# EAGLE schematic EasyCheck_rev1 (EAGLE 9.4.0)
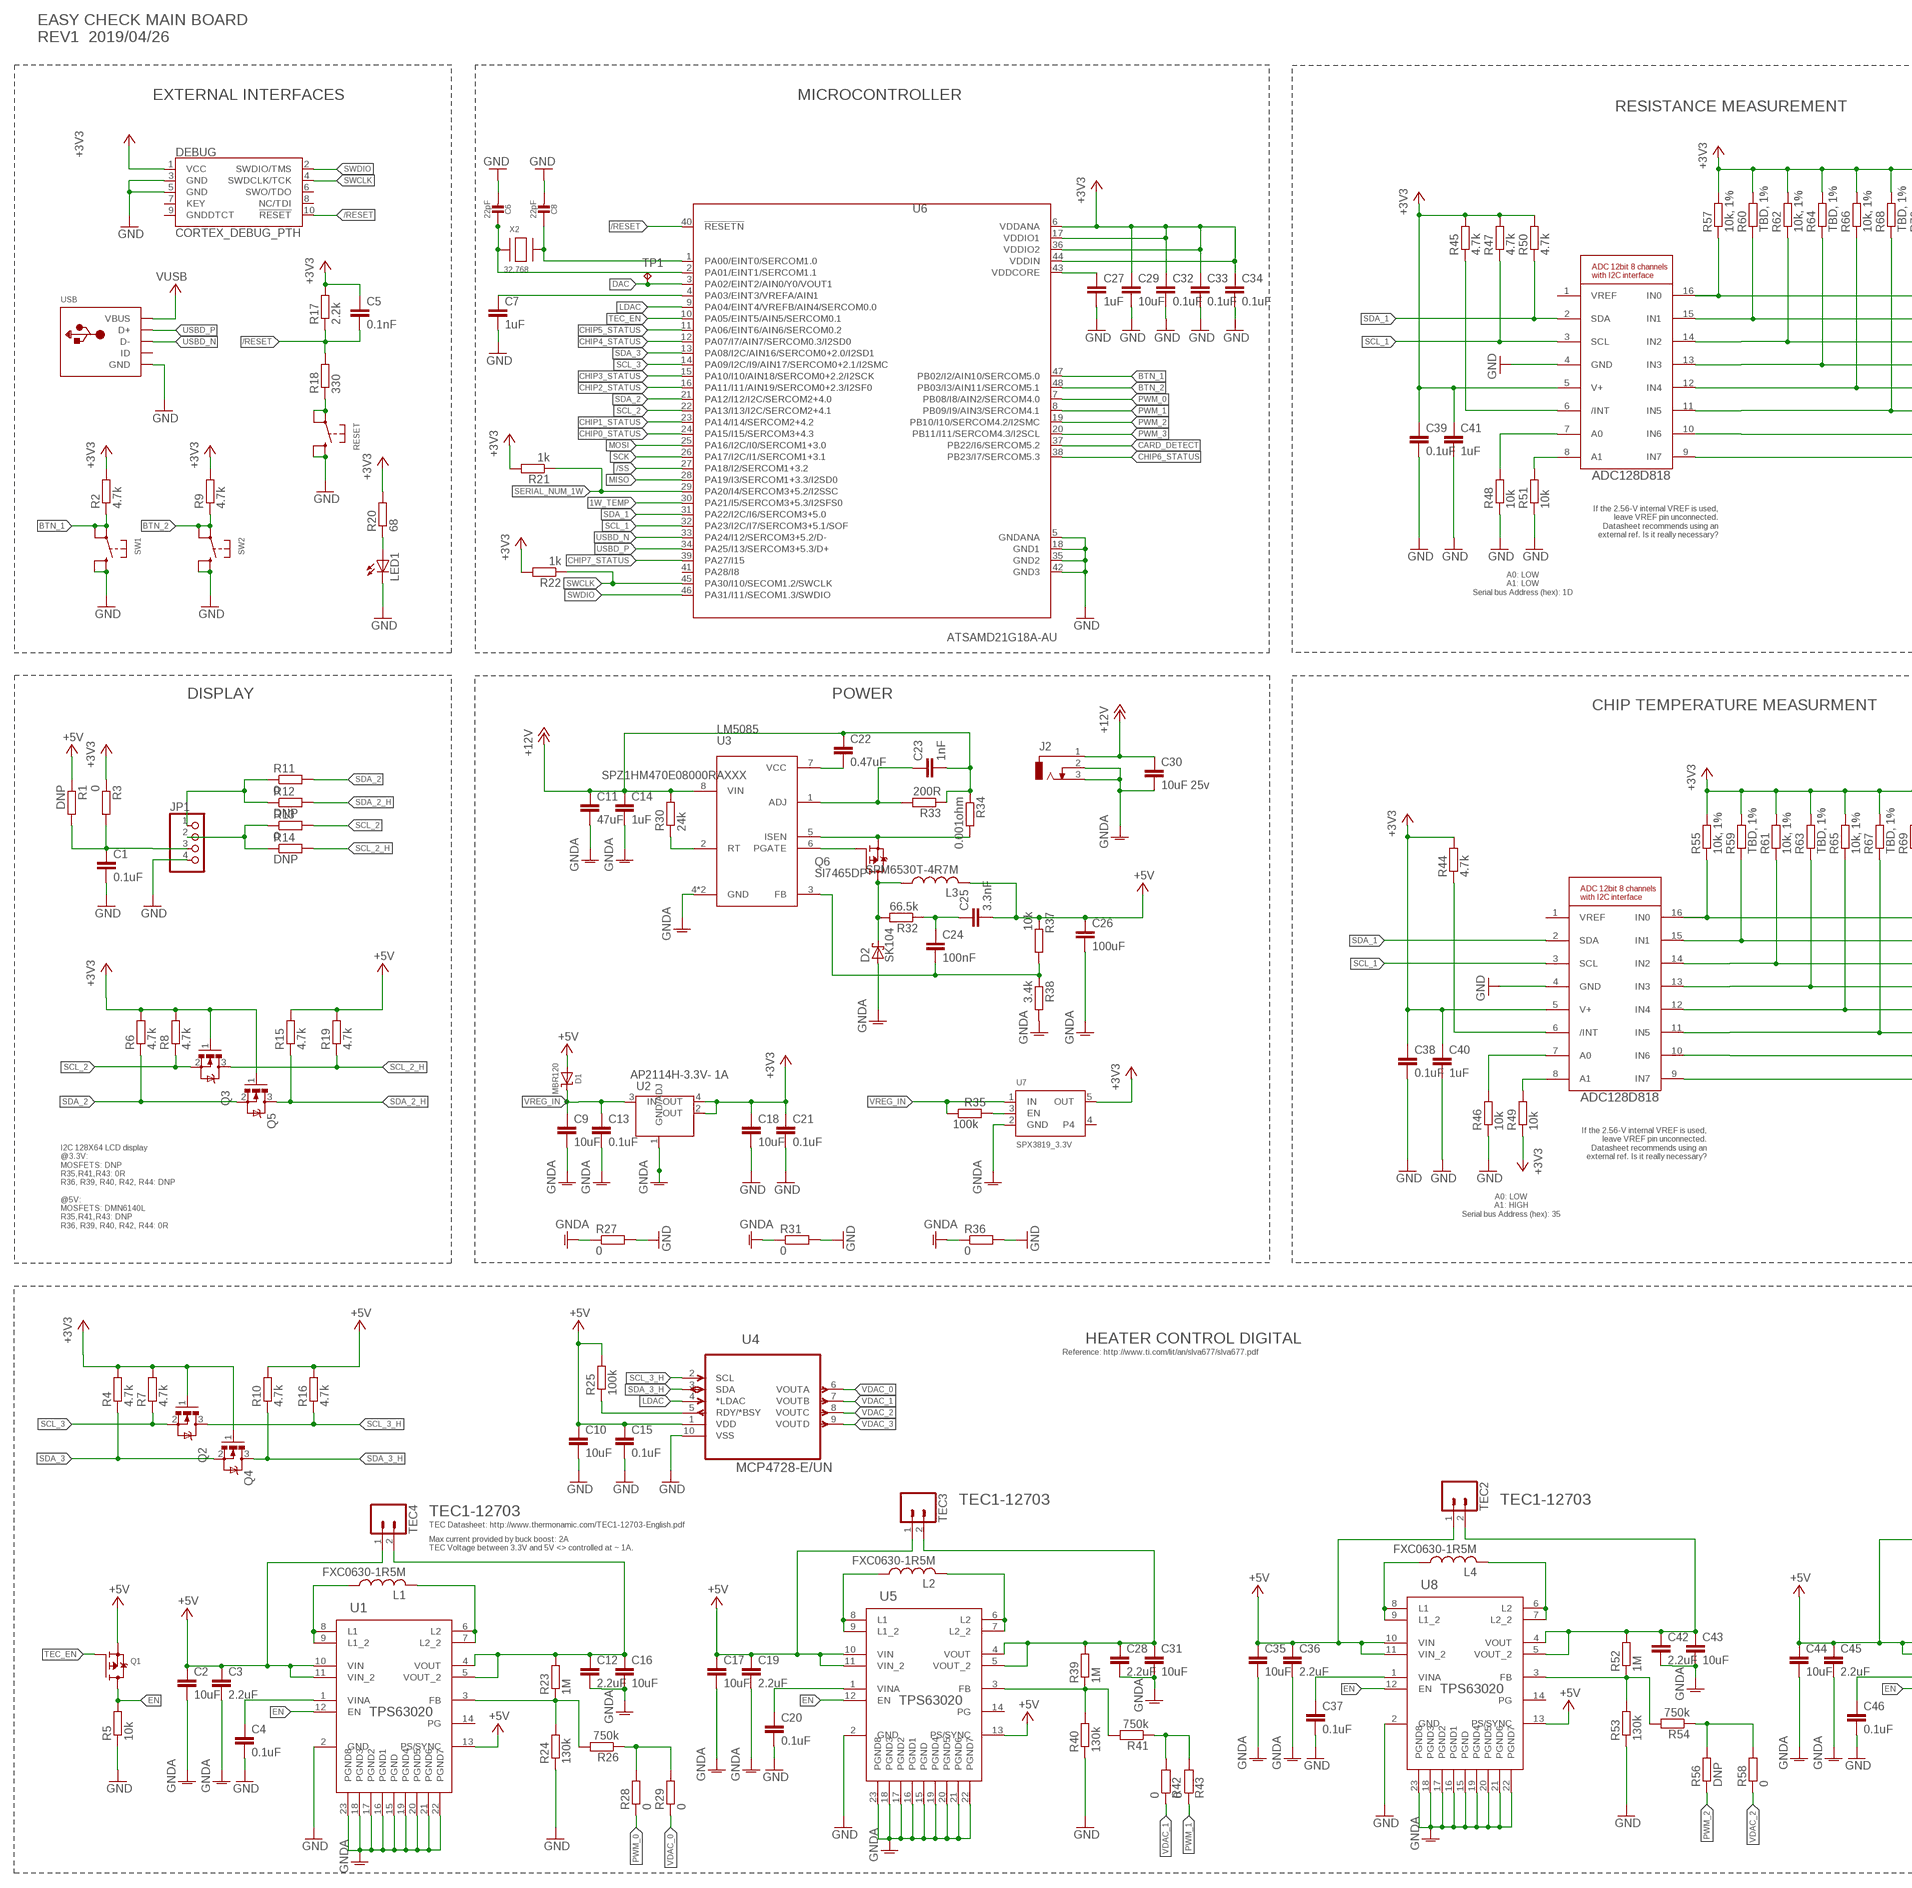
[diagram p0: schematic, sheet 1, part 1 of 2]
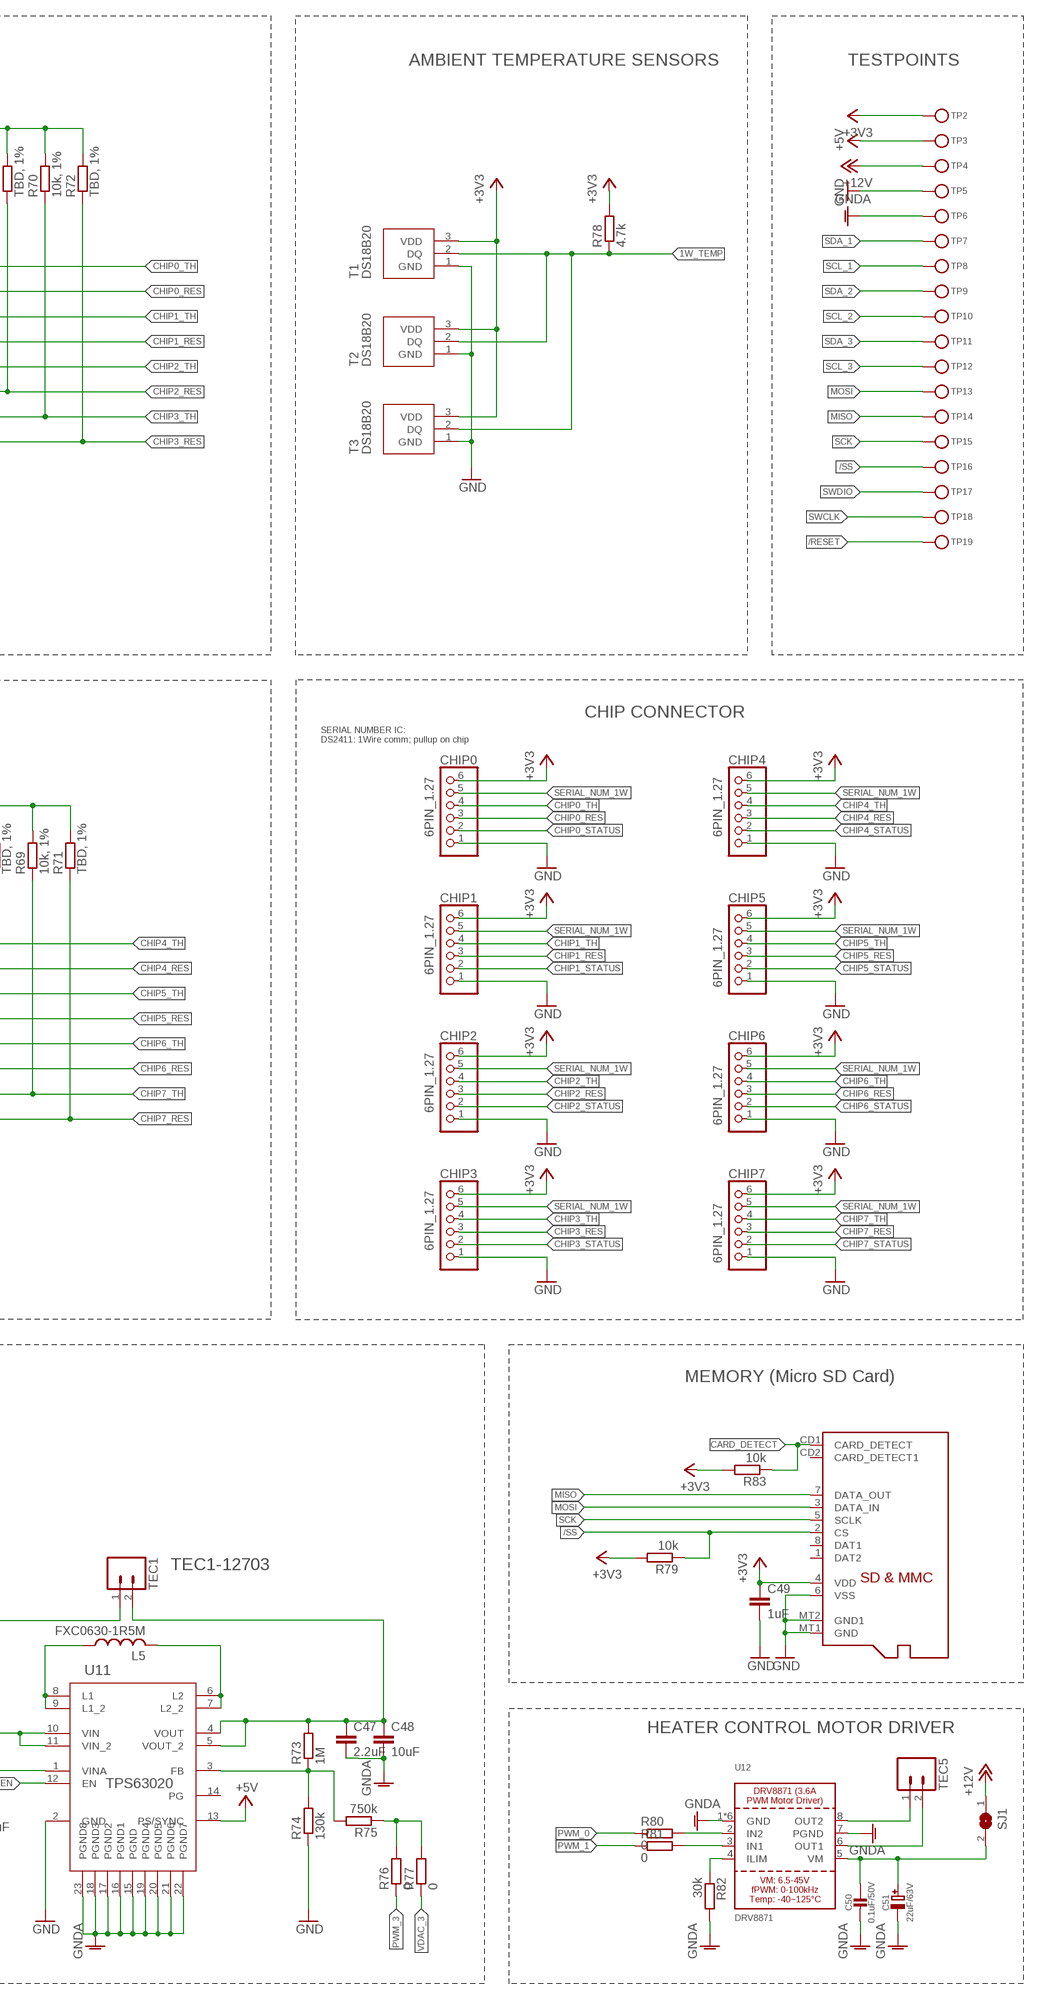
[diagram p1: schematic, sheet 1, part 2 of 2]

## Parts
C1  0.1uF  C-EUC0603  [C0603]
C2  10uF  C-EUC0805  [C0805]
C3  2.2uF  C-EUC0805  [C0805]
C4  0.1uF  C-EUC0603  [C0603]
C5  0.1nF  C-EUC0603  [C0603]
C6  22pF  CAP_CERAMIC0603_NO  [0603-NO]
C7  1uF  C-EUC0603  [C0603]
C8  22pF  CAP_CERAMIC0603_NO  [0603-NO]
C9  10uF  C-EUC0603  [C0603]
C10  10uF  C-EUC0603  [C0603]
C11  47uF  C-EUC1206  [C1206]
C12  2.2uF  C-EUC0805  [C0805]
C13  0.1uF  C-EUC0603  [C0603]
C14  1uF  C-EUC1206  [C1206]
C15  0.1uF  C-EUC0603  [C0603]
C16  10uF  C-EUC0805  [C0805]
C17  10uF  C-EUC0805  [C0805]
C18  10uF  C-EUC0603  [C0603]
C19  2.2uF  C-EUC0805  [C0805]
C20  0.1uF  C-EUC0603  [C0603]
C21  0.1uF  C-EUC0603  [C0603]
C22  0.47uF  C-EUC1206  [C1206]
C23  1nF  C-EUC0603  [C0603]
C24  100nF  C-EUC0603  [C0603]
C25  3.3nF  C-EUC0603  [C0603]
C26  100uF  C-EUC1206  [C1206]
C27  1uF  C-EUC0603  [C0603]
C28  2.2uF  C-EUC0805  [C0805]
C29  10uF  C-EUC0603  [C0603]
C30  10uF 25v  C-EUC1206  [C1206]
C31  10uF  C-EUC0805  [C0805]
C32  0.1uF  C-EUC0603  [C0603]
C33  0.1uF  C-EUC0603  [C0603]
C34  0.1uF  C-EUC0603  [C0603]
C35  10uF  C-EUC0603  [C0603]
C36  2.2uF  C-EUC0603  [C0603]
C37  0.1uF  C-EUC0603  [C0603]
C38  0.1uF  C-EUC0603  [C0603]
C39  0.1uF  C-EUC0603  [C0603]
C40  1uF  C-EUC0603  [C0603]
C41  1uF  C-EUC0603  [C0603]
C42  2.2uF  C-EUC0805  [C0805]
C43  10uF  C-EUC0805  [C0805]
C44  10uF  C-EUC0805  [C0805]
C45  2.2uF  C-EUC0805  [C0805]
C46  0.1uF  C-EUC0603  [C0603]
C47  2.2uF  C-EUC0805  [C0805]
C48  10uF  C-EUC0805  [C0805]
C49  1uF  C-EUC0603  [C0603]
C50  0.1uF/50V  CAP_CERAMIC0805-NOOUTLINE  [0805-NO]
C51  22uF/63V  CAP_ELECTROLYTICPANASONIC_D  [PANASONIC_D]
CHIP0  6PIN_1.27  [6X1PIN_1.27]
CHIP1  6PIN_1.27  [6X1PIN_1.27]
CHIP2  6PIN_1.27  [6X1PIN_1.27]
CHIP3  6PIN_1.27  [6X1PIN_1.27]
CHIP4  6PIN_1.27  [6X1PIN_1.27]
CHIP5  6PIN_1.27  [6X1PIN_1.27]
CHIP6  6PIN_1.27  [6X1PIN_1.27]
CHIP7  6PIN_1.27  [6X1PIN_1.27]
D1  MBR120  MICROBUILDER_DIODE-SCHOTTKYSOD-123  [MICROBUILDER_SOD-123]
D2  SK104  [SK104]
DEBUG  CORTEX_DEBUG_PTH  [2X5-PTH-1.27MM]
J2  DCJ0303  [DCJ0303]
JP1  PINHD-1X4  [1X04]
L1  FXC0630-1R5M  L-USPIS2816  [PIS2816]
L2  FXC0630-1R5M  L-USPIS2816  [PIS2816]
L3  SPM6530T-4R7M  [SPM6530T-4R7M]
L4  FXC0630-1R5M  L-USPIS2816  [PIS2816]
L5  FXC0630-1R5M  L-USPIS2816  [PIS2816]
LED1  LEDCHIPLED_0603  [CHIPLED_0603]
Q1  MICROBUILDER_MOSFET-P  [MICROBUILDER_SOT23-R]
Q2  DMN6140L  [SOT91P240X110-3N]
Q3  DMN6140L  [SOT91P240X110-3N]
Q4  DMN6140L  [SOT91P240X110-3N]
Q5  DMN6140L  [SOT91P240X110-3N]
Q6  SI7465DP  [SI7465]
R1  DNP  R-EU_R0603  [R0603]
R2  4.7k  R-EU_R0603  [R0603]
R3  0  R-EU_R0603  [R0603]
R4  4.7k  R-EU_R0603  [R0603]
R5  10k  R-EU_R0603  [R0603]
R6  4.7k  R-EU_R0603  [R0603]
R7  4.7k  R-EU_R0603  [R0603]
R8  4.7k  R-EU_R0603  [R0603]
R9  4.7k  R-EU_R0603  [R0603]
R10  4.7k  R-EU_R0603  [R0603]
R11  0  R-EU_R0603  [R0603]
R12  DNP  R-EU_R0603  [R0603]
R13  0  R-EU_R0603  [R0603]
R14  DNP  R-EU_R0603  [R0603]
R15  4.7k  R-EU_R0603  [R0603]
R16  4.7k  R-EU_R0603  [R0603]
R17  2.2k  R-EU_R0603  [R0603]
R18  330  R-EU_R0603  [R0603]
R19  4.7k  R-EU_R0603  [R0603]
R20  68  R-EU_R0603  [R0603]
R21  1k  R-EU_R0603  [R0603]
R22  1k  R-EU_R0603  [R0603]
R23  1M  R-EU_R0603  [R0603]
R24  130k  R-EU_R0603  [R0603]
R25  100k  R-EU_R0603  [R0603]
R26  750k  R-EU_R0603  [R0603]
R27  0  R-EU_R0603  [R0603]
R28  0  R-EU_R0603  [R0603]
R29  0  R-EU_R0603  [R0603]
R30  24k  R-EU_R0603  [R0603]
R31  0  R-EU_R0603  [R0603]
R32  66.5k  R-EU_R0603  [R0603]
R33  200R  R-EU_R0603  [R0603]
R34  0.001ohm  R-EU_R1206  [R1206]
R35  100k  R-EU_R0603  [R0603]
R36  0  R-EU_R0603  [R0603]
R37  10k  R-EU_R0603  [R0603]
R38  3.4k  R-EU_R0603  [R0603]
R39  1M  R-EU_R0603  [R0603]
R40  130k  R-EU_R0603  [R0603]
R41  750k  R-EU_R0603  [R0603]
R42  0  R-EU_R0603  [R0603]
R43  0  R-EU_R0603  [R0603]
R44  4.7k  R-EU_R0603  [R0603]
R45  4.7k  R-EU_R0603  [R0603]
R46  10k  R-EU_R0603  [R0603]
R47  4.7k  R-EU_R0603  [R0603]
R48  10k  R-EU_R0603  [R0603]
R49  10k  R-EU_R0603  [R0603]
R50  4.7k  R-EU_R0603  [R0603]
R51  10k  R-EU_R0603  [R0603]
R52  1M  R-EU_R0603  [R0603]
R53  130k  R-EU_R0603  [R0603]
R54  750k  R-EU_R0603  [R0603]
R55  10k, 1%  R-EU_R0603  [R0603]
R56  DNP  R-EU_R0603  [R0603]
R57  10k, 1%  R-EU_R0603  [R0603]
R58  0  R-EU_R0603  [R0603]
R59  TBD, 1%  R-EU_R0603  [R0603]
R60  TBD, 1%  R-EU_R0603  [R0603]
R61  10k, 1%  R-EU_R0603  [R0603]
R62  10k, 1%  R-EU_R0603  [R0603]
R63  TBD, 1%  R-EU_R0603  [R0603]
R64  TBD, 1%  R-EU_R0603  [R0603]
R65  10k, 1%  R-EU_R0603  [R0603]
R66  10k, 1%  R-EU_R0603  [R0603]
R67  TBD, 1%  R-EU_R0603  [R0603]
R68  TBD, 1%  R-EU_R0603  [R0603]
R69  10k, 1%  R-EU_R0603  [R0603]
R70  10k, 1%  R-EU_R0603  [R0603]
R71  TBD, 1%  R-EU_R0603  [R0603]
R72  TBD, 1%  R-EU_R0603  [R0603]
R73  1M  R-EU_R0603  [R0603]
R74  130k  R-EU_R0603  [R0603]
R75  750k  R-EU_R0603  [R0603]
R76  0  R-EU_R0603  [R0603]
R77  0  R-EU_R0603  [R0603]
R78  4.7k  R-EU_R0603  [R0603]
R79  10k  R-EU_R0603  [R0603]
R80  0  R-EU_R0603  [R0603]
R81  0  R-EU_R0603  [R0603]
R82  30k  R-EU_R0603  [R0603]
R83  10k  R-EU_R0603  [R0603]
RESET  MICROBUILDER_SWITCH_TACT_SMT_EVQQ2_SMALL  [MICROBUILDER_EVQ-Q2_SMALLER]
SD1  MICROSD  [MICROSD]
SJ1  SJW  [SJW]
SW1  MICROBUILDER_SWITCH_TACT_SMT_EVQQ2_SMALL  [MICROBUILDER_EVQ-Q2_SMALLER]
SW2  MICROBUILDER_SWITCH_TACT_SMT_EVQQ2_SMALL  [MICROBUILDER_EVQ-Q2_SMALLER]
T1  DS18B20  [TO92]
T2  DS18B20  [TO92]
T3  DS18B20  [TO92]
TEC1  SPARKFUN-CONNECTORS_M025MM  [SPARKFUN-CONNECTORS_SCREWTERMINAL-5MM-2$1]
TEC2  SPARKFUN-CONNECTORS_M025MM  [SPARKFUN-CONNECTORS_SCREWTERMINAL-5MM-2$1]
TEC3  SPARKFUN-CONNECTORS_M025MM  [SPARKFUN-CONNECTORS_SCREWTERMINAL-5MM-2$1]
TEC4  SPARKFUN-CONNECTORS_M025MM  [SPARKFUN-CONNECTORS_SCREWTERMINAL-5MM-2$1]
TEC5  SPARKFUN-CONNECTORS_M025MM  [SPARKFUN-CONNECTORS_SCREWTERMINAL-5MM-2$1]
TP1  TPPAD1-17  [P1-17]
TP2  MICROBUILDER_TESTPOINTROUND1.5MM  [MICROBUILDER_TESTPOINT_ROUND_1.5MM]
TP3  MICROBUILDER_TESTPOINTROUND1.5MM  [MICROBUILDER_TESTPOINT_ROUND_1.5MM]
TP4  MICROBUILDER_TESTPOINTROUND1.5MM  [MICROBUILDER_TESTPOINT_ROUND_1.5MM]
TP5  MICROBUILDER_TESTPOINTROUND1.5MM  [MICROBUILDER_TESTPOINT_ROUND_1.5MM]
TP6  MICROBUILDER_TESTPOINTROUND1.5MM  [MICROBUILDER_TESTPOINT_ROUND_1.5MM]
TP7  MICROBUILDER_TESTPOINTROUND1.5MM  [MICROBUILDER_TESTPOINT_ROUND_1.5MM]
TP8  MICROBUILDER_TESTPOINTROUND1.5MM  [MICROBUILDER_TESTPOINT_ROUND_1.5MM]
TP9  MICROBUILDER_TESTPOINTROUND1.5MM  [MICROBUILDER_TESTPOINT_ROUND_1.5MM]
TP10  MICROBUILDER_TESTPOINTROUND1.5MM  [MICROBUILDER_TESTPOINT_ROUND_1.5MM]
TP11  MICROBUILDER_TESTPOINTROUND1.5MM  [MICROBUILDER_TESTPOINT_ROUND_1.5MM]
TP12  MICROBUILDER_TESTPOINTROUND1.5MM  [MICROBUILDER_TESTPOINT_ROUND_1.5MM]
TP13  MICROBUILDER_TESTPOINTROUND1.5MM  [MICROBUILDER_TESTPOINT_ROUND_1.5MM]
TP14  MICROBUILDER_TESTPOINTROUND1.5MM  [MICROBUILDER_TESTPOINT_ROUND_1.5MM]
TP15  MICROBUILDER_TESTPOINTROUND1.5MM  [MICROBUILDER_TESTPOINT_ROUND_1.5MM]
TP16  MICROBUILDER_TESTPOINTROUND1.5MM  [MICROBUILDER_TESTPOINT_ROUND_1.5MM]
TP17  MICROBUILDER_TESTPOINTROUND1.5MM  [MICROBUILDER_TESTPOINT_ROUND_1.5MM]
TP18  MICROBUILDER_TESTPOINTROUND1.5MM  [MICROBUILDER_TESTPOINT_ROUND_1.5MM]
TP19  MICROBUILDER_TESTPOINTROUND1.5MM  [MICROBUILDER_TESTPOINT_ROUND_1.5MM]
U1  TPS63020  [QFN14-3X4MM]
U2  AP2114H-3.3V- 1A  GEN_COMP_LINEAR_MC33269ST  [GEN_COMP_SOT223]
U3  LM5085  [LM5085]
U4  MCP4728-E/UN  [SOP50P490X110-10N]
U5  TPS63020  [QFN14-3X4MM]
U6  ATSAMD21G18A-AU  [QFP50P900X900X120-48N]
U7  SPX3819_3.3V  MICROBUILDER_VREG_SOT23-5  [MICROBUILDER_SOT23-5]
U8  TPS63020  [QFN14-3X4MM]
U9  LMD128D818  [ADC128D818]
U10  LMD128D818  [ADC128D818]
U11  TPS63020  [QFN14-3X4MM]
U12  DRV8871  [HSOP8]
USB  MICROBUILDER_USB_MICRO_20329_V2  [MICROBUILDER_4UCONN_20329_V2]
X2  32.768  XTAL-3.2X1.5  [XTAL3215]

## Nets
1W_TEMP: R78.1 T1.2(DQ) T2.2(DQ) T3.2(DQ) U6.30(PA21/I5/SERCOM3+5.3/I2SFS0)
+3V3: C5.1 C18.1 C21.1 C29.1 C32.1 C33.1 C34.1 C38.1 C39.1 C40.1 C41.1 C49.1 CHIP0.6 CHIP1.6 CHIP2.6 CHIP3.6 CHIP4.6 CHIP5.6 CHIP6.6 CHIP7.6 DEBUG.1(VCC) Q2.1 Q3.1 Q4.1 Q5.1 R2.2 R3.1 R4.2 R6.2 R7.2 R8.2 R9.2 R17.2 R20.2 R21.2 R22.2 R44.2 R45.2 R47.2 R49.1 R50.2 R55.2 R57.2 R59.2 R60.2 R61.2 R62.2 R63.2 R64.2 R65.2 R66.2 R67.2 R68.2 R69.2 R70.2 R71.2 R72.2 R78.2 R79.2 R83.2 SD1.4(VDD) T1.3(VDD) T2.3(VDD) T3.3(VDD) TP2.P$1 U2.2(OUT) U2.4(OUT) U6.6(VDDANA) U6.17(VDDIO1) U6.36(VDDIO2) U6.44(VDDIN) U7.5(OUT) U9.5(V+) U10.5(V+)
+5V: C2.1 C3.1 C10.1 C15.1 C17.1 C19.1 C25.2 C26.1 C35.1 C36.1 C44.1 C45.1 D1.A L3.2 Q1.2(S) R1.1 R10.2 R15.2 R16.2 R19.2 R25.2 R37.1 TEC1.1 TEC2.1 TEC3.1 TEC4.1 TP3.P$1 U1.10(VIN) U1.11(VIN_2) U1.13(PS/SYNC) U4.1(VDD) U5.10(VIN) U5.11(VIN_2) U5.13(PS/SYNC) U8.10(VIN) U8.11(VIN_2) U8.13(PS/SYNC) U11.10(VIN) U11.11(VIN_2) U11.13(PS/SYNC)
+12V: C11.1 C14.1 C22.1 C23.2 C30.1 J2.1 R30.2 R33.1 R34.1 SJ1.1 TP4.P$1 U3.8(VIN)
/RESET: C5.2 DEBUG.10(!RESET) R17.1 R18.2 TP19.P$1 U6.40(!RESETN)
/SS: R79.1 SD1.2(CS) TP16.P$1 U6.27(PA18/I2/SERCOM1+3.2)
BTN_1: R2.1 SW1.A'(P1) SW1.A(P) U6.47(PB02/I2/AIN10/SERCOM5.0)
BTN_2: R9.1 SW2.A'(P1) SW2.A(P) U6.48(PB03/I3/AIN11/SERCOM5.1)
CARD_DETECT: R83.1 SD1.CD1(CARD_DETECT) U6.37(PB22/I6/SERCOM5.2)
CHIP0_RES: CHIP0.3 R60.1 U10.15(IN1)
CHIP0_STATUS: CHIP0.2 U6.24(PA15/I15/SERCOM3+4.3)
CHIP0_TH: CHIP0.4 R57.1 U10.16(IN0)
CHIP1_RES: CHIP1.3 R64.1 U10.13(IN3)
CHIP1_STATUS: CHIP1.2 U6.23(PA14/I14/SERCOM2+4.2)
CHIP1_TH: CHIP1.4 R62.1 U10.14(IN2)
CHIP2_RES: CHIP2.3 R68.1 U10.11(IN5)
CHIP2_STATUS: CHIP2.2 U6.16(PA11/I11/AIN19/SERCOM0+2.3/I2SF0)
CHIP2_TH: CHIP2.4 R66.1 U10.12(IN4)
CHIP3_RES: CHIP3.3 R72.1 U10.9(IN7)
CHIP3_STATUS: CHIP3.2 U6.15(PA10/I10/AIN18/SERCOM0+2.2/I2SCK)
CHIP3_TH: CHIP3.4 R70.1 U10.10(IN6)
CHIP4_RES: CHIP4.3 R59.1 U9.15(IN1)
CHIP4_STATUS: CHIP4.2 U6.12(PA07/I7/AIN7/SERCOM0.3/I2SD0)
CHIP4_TH: CHIP4.4 R55.1 U9.16(IN0)
CHIP5_RES: CHIP5.3 R63.1 U9.13(IN3)
CHIP5_STATUS: CHIP5.2 U6.11(PA06/EINT6/AIN6/SERCOM0.2)
CHIP5_TH: CHIP5.4 R61.1 U9.14(IN2)
CHIP6_RES: CHIP6.3 R67.1 U9.11(IN5)
CHIP6_STATUS: CHIP6.2 U6.38(PB23/I7/SERCOM5.3)
CHIP6_TH: CHIP6.4 R65.1 U9.12(IN4)
CHIP7_RES: CHIP7.3 R71.1 U9.9(IN7)
CHIP7_STATUS: CHIP7.2 U6.39(PA27/I15)
CHIP7_TH: CHIP7.4 R69.1 U9.10(IN6)
DAC: TP1.TP U6.3(PA02/EINT2/AIN0/Y0/VOUT1)
EN: Q1.3(D) R5.2 U1.12(EN) U5.12(EN) U8.12(EN) U11.12(EN)
GND: C1.2 C4.2 C6.2 C7.2 C8.2 C10.2 C15.2 C18.2 C20.2 C21.2 C27.2 C29.2 C32.2 C33.2 C34.2 C37.2 C38.2 C39.2 C40.2 C41.2 C46.2 C49.2 CHIP0.1 CHIP1.1 CHIP2.1 CHIP3.1 CHIP4.1 CHIP5.1 CHIP6.1 CHIP7.1 DEBUG.3(GND) DEBUG.5(GND) JP1.4 LED1.C R5.1 R24.1 R27.2 R31.2 R36.2 R40.1 R46.1 R48.1 R51.1 R53.1 R74.1 RESET.B'(S1) RESET.B(S) SD1.6(VSS) SD1.MT1(GND) SD1.MT2(GND1) SW1.B'(S1) SW1.B(S) SW2.B'(S1) SW2.B(S) T1.1(GND) T2.1(GND) T3.1(GND) TP5.P$1 U1.2(GND) U4.10(VSS) U5.2(GND) U6.5(GNDANA) U6.18(GND1) U6.35(GND2) U6.42(GND3) U8.2(GND) U9.4(GND) U10.4(GND) U11.2(GND) USB.BASE@1(GND) USB.BASE@2(GND) USB.GND USB.SPRT@1(GND) USB.SPRT@2(GND) USB.SPRT@3(GND) USB.SPRT@4(GND)
GNDA: C2.2 C3.2 C9.2 C11.2 C12.2 C13.2 C14.2 C16.2 C17.2 C19.2 C26.2 C28.2 C30.2 C31.2 C35.2 C36.2 C42.2 C43.2 C44.2 C45.2 C47.2 C48.2 C50.2 C51.- D2.1(A) J2.2 J2.3 R27.1 R31.1 R36.1 R38.2 R82.2 TP6.P$1 U1.15(PGND) U1.16(PGND1) U1.17(PGND2) U1.18(PGND3) U1.19(PGND4) U1.20(PGND5) U1.21(PGND6) U1.22(PGND7) U1.23(PGND8) U2.1(GND/ADJ) U3.4(GND) U3.9(GND) U5.15(PGND) U5.16(PGND1) U5.17(PGND2) U5.18(PGND3) U5.19(PGND4) U5.20(PGND5) U5.21(PGND6) U5.22(PGND7) U5.23(PGND8) U7.2(GND) U8.15(PGND) U8.16(PGND1) U8.17(PGND2) U8.18(PGND3) U8.19(PGND4) U8.20(PGND5) U8.21(PGND6) U8.22(PGND7) U8.23(PGND8) U11.15(PGND) U11.16(PGND1) U11.17(PGND2) U11.18(PGND3) U11.19(PGND4) U11.20(PGND5) U11.21(PGND6) U11.22(PGND7) U11.23(PGND8) U12.1(GND) U12.7(PGND) U12.GND U12.P$1(GND) U12.P$2(GND) U12.P$3(GND) U12.P$4(GND)
LDAC: U4.4(*LDAC) U6.9(PA04/EINT4/VREFB/AIN4/SERCOM0.0)
MISO: SD1.7(DATA_OUT) TP14.P$1 U6.28(PA19/I3/SERCOM1+3.3/I2SD0)
MOSI: SD1.3(DATA_IN) TP13.P$1 U6.25(PA16/I2C/I0/SERCOM1+3.0)
N$1: R45.1 U10.6(/INT)
N$2: R44.1 U9.6(/INT)
N$3: R48.2 U10.7(A0)
N$4: R51.2 U10.8(A1)
N$5: R46.2 U9.7(A0)
N$6: R49.2 U9.8(A1)
N$7: USB.VBUS ; supply symbol labelled VUSB
N$8: R18.1 RESET.A'(P1) RESET.A(P)
N$10: R35.2 U7.3(EN)
N$11: JP1.1 R11.1 R12.1
N$13: C6.1 U6.2(PA01/EINT1/SERCOM1.1) X2.P$1
N$14: C8.1 U6.1(PA00/EINT0/SERCOM1.0) X2.P$2
N$15: C7.1 U6.4(PA03/EINT3/VREFA/AIN1)
N$16: C27.1 U6.43(VDDCORE)
N$17: LED1.A R20.1
N$18: JP1.2 R13.1 R14.1
N$19: R26.1 R28.2 R29.2
N$20: R23.1 R24.2 R26.2 U1.3(FB)
N$21: C4.1 U1.1(VINA)
N$22: L1.1 U1.8(L1) U1.9(L1_2)
N$23: C12.1 C16.1 R23.2 TEC4.2 U1.4(VOUT) U1.5(VOUT_2)
N$24: L1.2 U1.6(L2) U1.7(L2_2)
N$25: R41.1 R42.2 R43.2
N$26: C20.1 U5.1(VINA)
N$27: R30.1 U3.2(RT)
N$28: R39.1 R40.2 R41.2 U5.3(FB)
N$29: C28.1 C31.1 R39.2 TEC3.2 U5.4(VOUT) U5.5(VOUT_2)
N$30: L2.1 U5.8(L1) U5.9(L1_2)
N$31: L2.2 U5.6(L2) U5.7(L2_2)
N$32: R25.1 U4.5(RDY/*BSY)
N$33: R54.1 R56.2 R58.2
N$34: C37.1 U8.1(VINA)
N$35: R52.1 R53.2 R54.2 U8.3(FB)
N$36: C42.1 C43.1 R52.2 TEC2.2 U8.4(VOUT) U8.5(VOUT_2)
N$37: L4.1 U8.8(L1) U8.9(L1_2)
N$38: L4.2 U8.6(L2) U8.7(L2_2)
N$39: Q6.1(S) Q6.2(S) Q6.3(S) R34.2 U3.5(ISEN)
N$40: R75.1 R76.2 R77.2
N$41: C23.1 R33.2 U3.1(ADJ)
N$42: C24.1 C25.1 R32.1
N$43: C24.2 R37.2 R38.1 U3.3(FB)
N$44: C46.1 U11.1(VINA)
N$45: R73.1 R74.2 R75.2 U11.3(FB)
N$46: C22.2 U3.7(VCC)
N$47: C47.1 C48.1 R73.2 TEC1.2 U11.4(VOUT) U11.5(VOUT_2)
N$48: L5.1 U11.8(L1) U11.9(L1_2)
N$49: L5.2 U11.6(L2) U11.7(L2_2)
N$50: D2.2(C) L3.1 Q6.5(D) Q6.6(D) Q6.7(D) Q6.8(D) Q6.9(D) R32.2
N$51: Q6.4(G) U3.6(PGATE)
N$52: R82.1 U12.4(ILIM)
N$53: R80.2 U12.2(IN2)
N$54: R81.2 U12.3(IN1)
N$55: C50.1 C51.+ SJ1.2 U12.5(VM)
OUT1: TEC5.2 U12.6(OUT1)
OUT2: TEC5.1 U12.8(OUT2)
PWM_0: R28.1 R80.1 U6.7(PB08/I8/AIN2/SERCOM4.0)
PWM_1: R43.1 R81.1 U6.8(PB09/I9/AIN3/SERCOM4.1)
PWM_2: R56.1 U6.19(PB10/I10/SERCOM4.2/I2SMC)
PWM_3: R76.1 U6.20(PB11/I11/SERCOM4.3/I2SCL)
SCK: SD1.5(SCLK) TP15.P$1 U6.26(PA17/I2C/I1/SERCOM1+3.1)
SCL_1: R47.1 TP8.P$1 U6.32(PA23/I2C/I7/SERCOM3+5.1/SOF) U9.3(SCL) U10.3(SCL)
SCL_2: Q3.2 R8.1 R13.2 TP10.P$1 U6.22(PA13/I13/I2C/SERCOM2+4.1)
SCL_2_H: Q3.3 R14.2 R19.1
SCL_3: Q2.2 R7.1 TP12.P$1 U6.14(PA09/I2C/I9/AIN17/SERCOM0+2.1/I2SMC)
SCL_3_H: Q2.3 R16.1 U4.2(SCL)
SDA_1: R50.1 TP7.P$1 U6.31(PA22/I2C/I6/SERCOM3+5.0) U9.2(SDA) U10.2(SDA)
SDA_2: Q5.2 R6.1 R11.2 TP9.P$1 U6.21(PA12/I12/I2C/SERCOM2+4.0)
SDA_2_H: Q5.3 R12.2 R15.1
SDA_3: Q4.2 R4.1 TP11.P$1 U6.13(PA08/I2C/AIN16/SERCOM0+2.0/I2SD1)
SDA_3_H: Q4.3 R10.1 U4.3(SDA)
SERIAL_NUM_1W: CHIP0.5 CHIP1.5 CHIP2.5 CHIP3.5 CHIP4.5 CHIP5.5 CHIP6.5 CHIP7.5 R21.1 U6.29(PA20/I4/SERCOM3+5.2/I2SSC)
SWCLK: DEBUG.4(SWDCLK/TCK) R22.1 TP18.P$1 U6.45(PA30/I10/SECOM1.2/SWCLK)
SWDIO: DEBUG.2(SWDIO/TMS) TP17.P$1 U6.46(PA31/I11/SECOM1.3/SWDIO)
TEC_EN: Q1.1(G) U6.10(PA05/EINT5/AIN5/SERCOM0.1)
USBD_N: U6.33(PA24/I12/SERCOM3+5.2/D-) USB.D-
USBD_P: U6.34(PA25/I13/SERCOM3+5.3/D+) USB.D+
VCC: C1.1 JP1.3 R1.2 R3.2
VDAC_0: R29.1 U4.6(VOUTA)
VDAC_1: R42.1 U4.7(VOUTB)
VDAC_2: R58.1 U4.8(VOUTC)
VDAC_3: R77.1 U4.9(VOUTD)
VREG_IN: C9.1 C13.1 D1.C R35.1 U2.3(IN) U7.1(IN)
Unconnected: DEBUG.6(SWO/TDO) DEBUG.7(KEY) DEBUG.8(NC/TDI) DEBUG.9(GNDDTCT) SD1.1(DAT2) SD1.8(DAT1) SD1.CD2(CARD_DETECT1) U1.14(PG) U5.14(PG) U6.41(PA28/I8) U7.4 U8.14(PG) U9.1(VREF) U10.1(VREF) U11.14(PG) USB.ID

## Notes on the sheet
- EASY CHECK MAIN BOARD
  REV1  2019/04/26
- EXTERNAL INTERFACES | MICROCONTROLLER
- RESISTANCE MEASUREMENT | AMBIENT TEMPERATURE SENSORS | TESTPOINTS
- If the 2.56-V internal VREF is used,
  leave VREF pin unconnected.
  Datasheet recommends using an
  external ref. Is it really necessary?
- A0: LOW
  A1: LOW
  Serial bus Address (hex): 1D
- DISPLAY | POWER
- CHIP TEMPERATURE MEASURMENT | CHIP CONNECTOR
- SERIAL NUMBER IC:
  DS2411: 1Wire comm; pullup on chip
- SPZ1HM470E08000RAXXX
- If the 2.56-V internal VREF is used,
  leave VREF pin unconnected.
  Datasheet recommends using an
  external ref. Is it really necessary?
- A0: LOW
  A1: HIGH
  Serial bus Address (hex): 35
- I2C 128X64 LCD display
  @3.3V: 
  MOSFETS: DNP
  R35,R41,R43: 0R
  R36, R39, R40, R42, R44: DNP
  
  @5V: 
  MOSFETS: DMN6140L
  R35,R41,R43: DNP
  R36, R39, R40, R42, R44: 0R
- MEMORY (Micro SD Card)
- HEATER CONTROL DIGITAL
- Reference: http://www.ti.com/lit/an/slva677/slva677.pdf
- TEC1-12703
- TEC1-12703 | TEC1-12703
- TEC1-12703
- TEC Datasheet: http://www.thermonamic.com/TEC1-12703-English.pdf
- Max current provided by buck boost: 2A
  TEC Voltage between 3.3V and 5V <> controlled at ~ 1A.
- HEATER CONTROL MOTOR DRIVER

## Library data of the parts
C1-C5 C7 C9-C49 = rcl:C-EU: CAPACITOR, European symbol; SPICEPREFIX: C
C6 C8 C50 = microbuilder:CAP_CERAMIC: Ceramic Capacitors For new designs, use the packages preceded by an '_' character since they are more reliable: The following footprints should be used on most boards: _0402 - Standard footprint for regular board layouts _0603 - Standard footprint for regular board layouts _0805 - Standard footprint for regular board layouts _1206 - Standard footprint for regular board layouts For extremely tight-pitch boards where space is at a premium, the following 'micro-pitch' footprints can be used (smaller pads, no silkscreen outline, etc.): _0402MP - Micro-pitch footprint for very dense/compact boards _0603MP - Micro-pitch footprint for very dense/compact boards _0805MP - Micro-pitch footprint for very dense/compact boards _1206MP - Micro-pitch footprint for very dense/compact boards
C51 = microbuilder:CAP_ELECTROLYTIC: Electrolytic Capacitors SMT PANASONIC_C - Size C Panasonic Electrolytic Aluminum Capacitor 47µF 16V 20% Electrolytic Capacitor [Digikey: PCE3890TR-ND] PANASONIC_D - Size D Panasonic Electrolytic Aluminum Capacitor 100µF 25V 20% Electrolytic Capacitor [Digikey: PCE3898TR-ND] PTH 3.5 mm grid, 8 mm diameter ... 3.5 mm grid, 10 mm diameter ...
CHIP0 CHIP1-CHIP7 = EasyCheck:6PIN_1.27
D1 = Adafruit Feather M0 Basic rev C:MICROBUILDER_DIODE-SCHOTTKY
D2 = Neptune_custom_lib:SK104
DEBUG = SparkFun-Connectors:CORTEX_DEBUG: Cortex Debug Connector - 10 pin Supports JTAG debug, Serial Wire debug, and Serial Wire Viewer. PTH and SMD connector options available. General Connector Information <http://infocenter.arm.com/help/topic/com.arm.doc.faqs/attached/13634/cortex_debug_connectors.pdf> Products: PTH Connector <http://www.digikey.com/product-detail/en/cnc-tech/3220-10-0100-00/1175-1627-ND/3883661> -via Digi-Key SparkFun PSoc <https://www.sparkfun.com/products/13229> SparkFun T <https://www.sparkfun.com/products/13810>
J2 = con-jack:DCJ0303: DC POWER JACK Source: DCJ0303.pdf; OC_FARNELL: unknown; OC_NEWARK: unknown
JP1 = pinhead:PINHD-1X4: PIN HEADER
L1 L2 L4 L5 = rcl:L-US: INDUCTOR, American symbol; SPICEPREFIX: L
L3 = Neptune_custom_lib:SPM6530T-4R7M
LED1 = led:LED: LED OSRAM: - CHIPLED LG R971, LG N971, LY N971, LG Q971, LY Q971, LO R971, LY R971 LH N974, LH R974 LS Q976, LO Q976, LY Q976 LO Q996 - Hyper CHIPLED LW Q18S LB Q993, LB Q99A, LB R99A - SideLED LS A670, LO A670, LY A670, LG A670, LP A670 LB A673, LV A673, LT A673, LW A673 LH A674 LY A675 LS A676, LA A676, LO A676, LY A676, LW A676 LS A679, LY A679, LG A679 - Hyper Micro SIDELED® LS Y876, LA Y876, LO Y876, LY Y876 LT Y87S - SmartLED LW L88C, LW L88S LB L89C, LB L89S, LG L890 LS L89K, LO L89K, LY L89K LS L896, LA L896, LO L896, LY L896 - TOPLED LS T670, LO T670, LY T670, LG T670, LP T670 LSG T670, LSP T670, LSY T670, LOP T670, LYG T670 LG T671, LOG T671, LSG T671 LB T673, LV T673, LT T673, LW T673 LH T674 LS T676, LA T676, LO T676, LY T676, LB T676, LH T676, LSB T676, LW T676 LB T67C, LV T67C, LT T67C, LS T67K, LO T67K, LY T67K, LW E67C LS E67B, LA E67B, LO E67B, LY E67B, LB E67C, LV E67C, LT E67C LW T67C LS T679, LY T679, LG T679 LS T770, LO T770, LY T770, LG T770, LP T770 LB T773, LV T773, LT T773, LW T773 LH T774 LS E675, LA E675, LY E675, LS T675 LS T776, LA T776, LO T776, LY T776, LB T776 LHGB T686 LT T68C, LB T68C - Hyper Mini TOPLED® LB M676 - Mini TOPLED Santana® LG M470 LS M47K, LO M47K, LY M47K Source: http://www.osram.convergy.de LUXEON: - LUMILED® LXK2-PW12-R00, LXK2-PW12-S00, LXK2-PW14-U00, LXK2-PW14-V00 LXK2-PM12-R00, LXK2-PM12-S00, LXK2-PM14-U00 LXK2-PE12-Q00, LXK2-PE12-R00, LXK2-PE12-S00, LXK2-PE14-T00, LXK2-PE14-U00 LXK2-PB12-K00, LXK2-PB12-L00, LXK2-PB12-M00, LXK2-PB14-N00, LXK2-PB14-P00, LXK2-PB14-Q00 LXK2-PR12-L00, LXK2-PR12-M00, LXK2-PR14-Q00, LXK2-PR14-R00 LXK2-PD12-Q00, LXK2-PD12-R00, LXK2-PD12-S00 LXK2-PH12-R00, LXK2-PH12-S00 LXK2-PL12-P00, LXK2-PL12-Q00, LXK2-PL12-R00 Source: www.luxeon.com KINGBRIGHT: KA-3528ASYC Source: www.kingbright.com
Q1 = Adafruit HUZZAH32 ESP32 Feather:MICROBUILDER_MOSFET-P: P-Channel Mosfet LEGEND VDS: Voltage Drain-Source ID: Drain Current RDS(ON): Drain-Source On-State Resistance VGS(TH): Gate-Source Threshold Voltage CISS: Drain-Source Input Capacitance SOT-23 Name VDS ID RDS(ON) VGS(TH) CISS Order Number IRLML5103 30V 760mA 600 mOhm -- 75pF @ 25V Digikey: IRLML5103PBFCT-ND IRLML6401 12V 4.3A 50 mOhm 950mV @ 250µA 830pF @ 10V Digikey: IRLML6401PBFTR-ND NTR0202PL 20V 400mA 800 mOhm 2.3V @ 250uA 70pF @ 5V Digikey: NTR0202PLT1GOSTR-ND NTR4101PT1G 20V 1.8A 85 mOhm 1.2V @ 250uA 675pF @ 10V Digikey: NTR4101PT1GOSCT-ND DMP2004K 20V 600mA 900 mOhm 1V @ 250uA 175pF @ 16V Digikey: DMP2004KDICT-ND PMV65XP 20V 3.9A 76 mOhm 950mV @ 1mA 725pF @ 20V Digikey: 568-2358-2-ND TO-252 Name VDS ID RDS(ON) VGS(TH) CISS Order Number AOD417 30V 25A 34 mOhm 3V @ 250µA 920pF @ 15V Digikey: 785-1106-2-ND PowerPak Name VDS ID RDS(ON) VGS(TH) CISS Order Number AON7401 30V 12A 14 mOhm 3V @ 250µA 2600pF @ 15V Digikey: 785-1302-1-ND
Q2-Q5 = DMN6140L:DMN6140L
Q6 = Neptune_custom_lib:SI7465DP
R1-R83 = rcl:R-EU_: RESISTOR, European symbol; SPICEPREFIX: R
RESET SW1 SW2 = Adafruit HUZZAH32 ESP32 Feather:MICROBUILDER_SWITCH_TACT_SMT: SMT Tact Switches 6x6mm - Digikey: P12940SCT-ND KMR2 (4.6x2.8mm) - Digikey: 401-1426-1-ND EVQ-PQHB55 - Light Touch, 160GF (4.5x4.5mm) - Digikey: P8090SCT-ND KMT0 - KMT021 NGJ LHS (etc.) IP68/Waterproof - Digikey: CKN10289CT-ND
SD1 = adafruit:MICROSD: Micro-SD / Transflash card holder with SPI pinout For the 3M # 2908-05WB-MG and/or 4UCON #19656 push-push type
SJ1 = jumper:SJ: SMD solder JUMPER
T1-T3 = Smart_socket:DS18B20
TEC1-TEC5 = SparkFun_ACS723_Current_Sensor_Breakout:SPARKFUN-CONNECTORS_M02: Standard 2-pin 0.1" header. Use with - straight break away headers ( PRT-00116) - right angle break away headers (PRT-00553) - swiss pins (PRT-00743) - machine pins (PRT-00117) - female headers (PRT-00115) Molex polarized connector foot print use with: PRT-08233 with associated crimp pins and housings. 2.54_SCREWTERM for use with PRT-10571. 3.5mm Screw Terminal footprints for PRT-08084 5mm Screw Terminal footprints for use with PRT-08432; STOREFRONT_ID: PRT-08432
TP1 = testpad:TP: Test pad
TP2-TP19 = Adafruit Feather M0 Basic rev C:MICROBUILDER_TESTPOINT: Test Point Various test points for characterisation and PCB testing TESTPOINT_SMT - Compact Surface Mount Test Point [Digikey: 5016KTR-ND]
U1 U5 U8 U11 = TPS63020:TPS63020; AVAILABILITY: Unavailable; DESCRIPTION: High Efficiency Single Inductor Buck-Boost Converter with 4A Switch; MF: Texas Instruments; MP: TPS63020; PACKAGE: VSON-14 Texas Instruments; PRICE: None
U2 = Arduino_Micro:GEN_COMP_LINEAR_MC33269ST*: Adjustable Output Low Dropout Voltage Regulator 800 mA Source: http://www.onsemi.com/pub/Collateral/MC33269-D.PDF
U3 = Neptune_custom_lib:LM5085
U4 = MCP4728:MCP4728-E/UN: IC, DAC, 12BIT, QUAD; MPN: MCP4728-E/UN; OC_FARNELL: 1800217; OC_NEWARK: 08R1808; PACKAGE: MSOP-10; SUPPLIER: MICROCHIP
U6 = ATSAMD21G18A-AU:ATSAMD21G18A-AU: Cortex-M0+, 256KB FLASH, 32KB SRAM, USB, DMA, T&R - 48TQFP IND TEMP, GREEN, 1.6-3.6V, 48MHz; AVAILABILITY: Unavailable; DESCRIPTION: SAMD21G Series 256 kB Flash 32 kB SRAM 48 MHz 32-Bit Microcontroller - TQFP-48; MF: Microchip; MP: ATSAMD21G18A-AU; PACKAGE: TQFP-48 Microchip; PRICE: None
U7 = Adafruit Feather M0 Basic rev C:MICROBUILDER_VREG_SOT23-5: SOT23-5 Fixed Voltage Regulators Part Current Out V Out V In V Dropout θJA (°C/W) TJ (°C) Digikey Part No. ADP121 150mA 3.3V 3.4-5.5V 0.09V @ 150mA -- -- ADP121-AUJZ33R7CT-ND ADP121 150mA 3.0V 3.1-5.5V 0.09V @ 150mA -- -- ADP121-AUJZ30R7CT-ND ADP122 300mA 3.3V 3.4-5.5V 0.085V @ 300mA -- -- ADP122AUJZ-3.3-R7CT-ND ADP1712 300mA 3.3V 3.5-5.5V 0.17V @ 300mA -- -- ADP1712AUJZ-3.3-R7TR-ND AP7311 (Low Cost) 150mA 3.3V 3.5-6V 0.15V @ 150mA -- -- AP7311-33WG-7DICT-ND LD39015M18R 150mA 1.8V 1.9V-5.5V 0.08V @ 100mA -- -- 497-6977-1-ND LP2985A-33DBVR 150mA 3.3V 3.3-16V 0.28V @ 150mA 206 150 296-18479-1-ND MCP1824T-3302E/OT 300mA 3.3V 3.5V-6V 0.2V @ 300mA -- -- MCP1824T-3302E/OTCT-ND MIC5205-2.5YM5 TR 150mA 2.5V 2.7-16V 0.165V @ 150mA -- -- 576-1257-2-ND MIC5205-3.0YM5 TR 150mA 3.0V 3.2V-16V 0.165V @ 150mA -- -- 576-1258-2-ND MIC5205-3.3YM5 TR 150mA 3.3V 3.5V-16V 0.165V @ 150mA -- -- 576-1259-2-ND TPS780330220 150mA 3.3V+2.2V 3.6-5.5V 250mV Max -- -- 296-23332-1-ND TDA3663/N1,135 100mA 3.3V 3.5-45V 0.18V @ 50mA -- -- 568-5343-1-ND Max operating temp can be calculated using θJA, TJ (max junction temperature), and power in watts. Set the "Maximum Ambient Temperature" until it reaches TJ ("Max Junction Temperature"), which is the absolute limit for safe use of the regulator: Heat Sink Temperature Calculator <http://www.daycounter.com/Calculators/Heat-Sink-Temperature-Calculator.phtml> For example, With 12V source into a 3.3V LP2985 and a 30mA load, we are dissipating (12V-3.3V) * 0.03A = 0.261W. With a θJA of 206 °C/W, a TJ of 150°C, and 261mW we can safely use the chip without a heat sink up to 75°C (=147.1°C Junction Temperature).
U9 U10 = ADS128D818:LMD128D818: ADC 12-Bit, 8-Channel, ADC System Monitor with Temperature Sensor, Internal/External Reference, and I2C Interface http://www.ti.com/product/adc128d818 http://fr.farnell.com/texas-instruments/adc128d818cimt-nopb/adc-12-bits-10sps-i2c-tssop-16/dp/2395888
U12 = microbuilder:DRV8871: DRV8871 - 3.6A PWM Motor Driver
USB = Adafruit ESP8266 Feather rev E:MICROBUILDER_USB: USB Connectors USBMINIB - Surface Mount Female Mini-B USB Connector 4UConnector: 06564
X2 = adafruit2:XTAL: Low cost SMT crystals, no capacitors included http://www.ladyada.net/library/eagle